# Altium schematic sheet mouse.SchDoc
size A; SheetNumber: 1; SheetTotal: 1
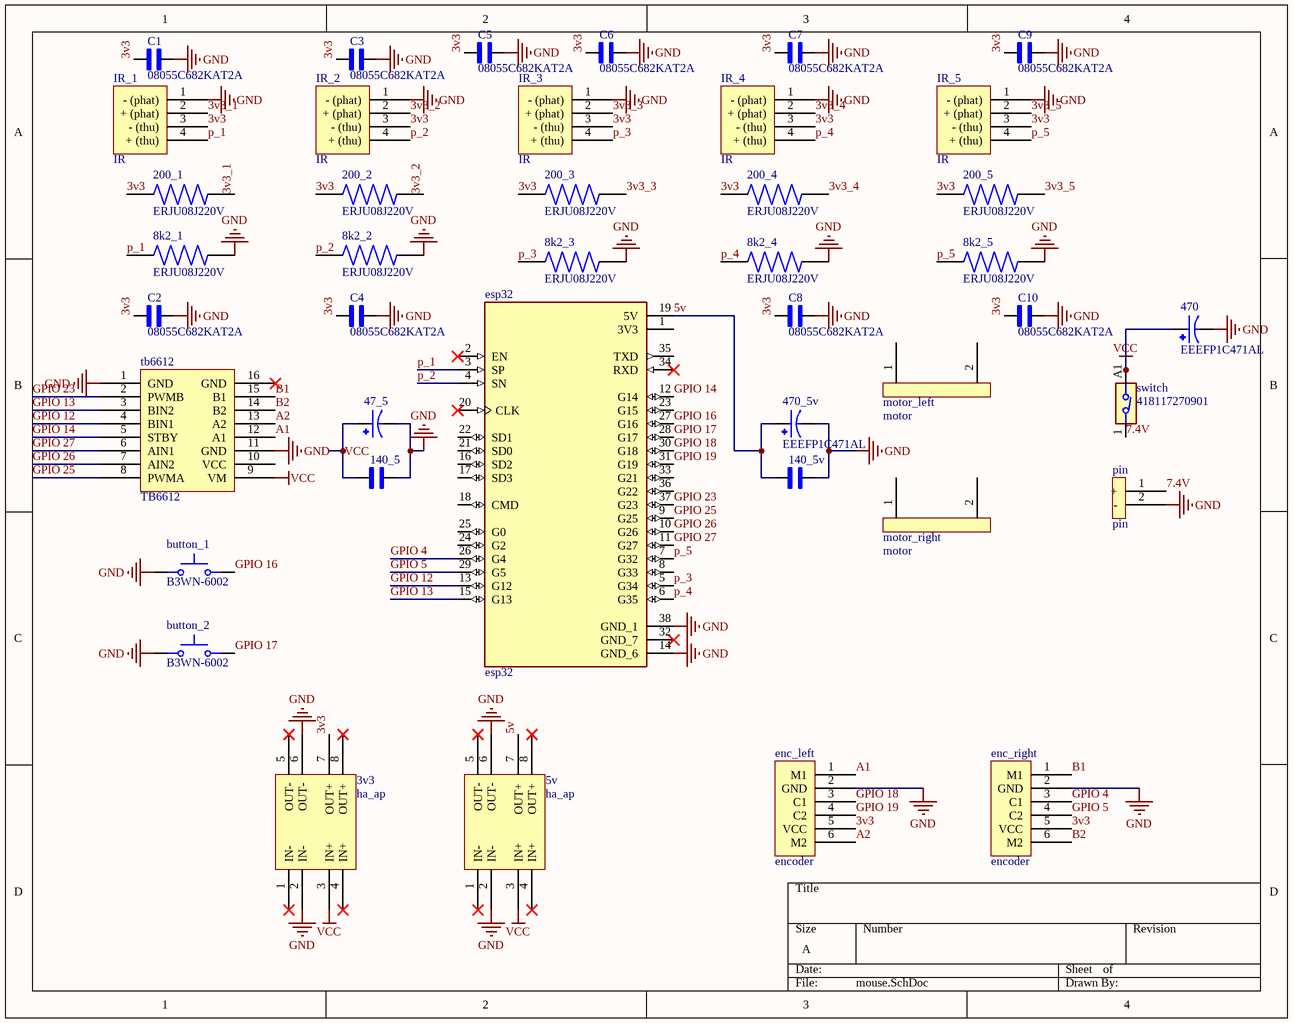
[diagram p0: mouse.SchDoc]

## Parts
3v3  ha_ap  [ha_ap]
5v  ha_ap  [ha_ap]
8k2_1  ERJU08J220V  [RES_ERJU08J220V]
8k2_2  ERJU08J220V  [RES_ERJU08J220V]
8k2_3  ERJU08J220V  [RES_ERJU08J220V]
8k2_4  ERJU08J220V  [RES_ERJU08J220V]
8k2_5  ERJU08J220V  [RES_ERJU08J220V]
47_5  EEEFK1C470V  [CAP_EEEFK1C470V]  (value not drawn)
140_5  08055C682KAT2A  [CAPC2012X94N]  (value not drawn)
140_5v  08055C682KAT2A  [CAPC2012X94N]  (value not drawn)
200_1  ERJU08J220V  [RES_ERJU08J220V]
200_2  ERJU08J220V  [RES_ERJU08J220V]
200_3  ERJU08J220V  [RES_ERJU08J220V]
200_4  ERJU08J220V  [RES_ERJU08J220V]
200_5  ERJU08J220V  [RES_ERJU08J220V]
470  EEEFP1C471AL  [CAP_EEEFP1C471AL]
470_5v  EEEFP1C471AL  [CAP_EEEFP1C471AL]
button_1  B3WN-6002  [SW_B3WN-6002]
button_2  B3WN-6002  [SW_B3WN-6002]
C1  08055C682KAT2A  [CAPC2012X94N]
C2  08055C682KAT2A  [CAPC2012X94N]
C3  08055C682KAT2A  [CAPC2012X94N]
C4  08055C682KAT2A  [CAPC2012X94N]
C5  08055C682KAT2A  [CAPC2012X94N]
C6  08055C682KAT2A  [CAPC2012X94N]
C7  08055C682KAT2A  [CAPC2012X94N]
C8  08055C682KAT2A  [CAPC2012X94N]
C9  08055C682KAT2A  [CAPC2012X94N]
C10  08055C682KAT2A  [CAPC2012X94N]
enc_left  encoder  [encoder]
enc_right  encoder  [encoder]
esp32  esp32  [esp32]
IR_1  IR  [IR]
IR_2  IR  [IR]
IR_3  IR  [IR]
IR_4  IR  [IR]
IR_5  IR  [IR]
motor_left  motor  [motor]
motor_right  motor  [motor]
pin  pin  [pin]
switch  418117270901  [418117270901]
tb6612  TB6612  [TB6612]

## Nets
GND: 3v3.2(IN-) 3v3.6(OUT-) 5v.2(IN-) 5v.6(OUT-) 8k2_1.2 8k2_2.2 8k2_3.2 8k2_4.2 8k2_5.2 47_5.2 140_5.2 140_5v.2 470.2 470_5v.2 button_1.1 button_2.1 C1.2 C2.2 C3.2 C4.2 C5.2 C6.2 C7.2 C8.2 C9.2 C10.2 enc_left.2(GND) enc_right.2(GND) esp32.14(GND_6) esp32.38(GND_1) IR_1.1(-_(phat)) IR_2.1(-_(phat)) IR_3.1(-_(phat)) IR_4.1(-_(phat)) IR_5.1(-_(phat)) pin.2(-) tb6612.1(GND) tb6612.11(GND)
VCC: 3v3.3(IN+) 5v.3(IN+) 47_5.1 140_5.1 470.1 switch.A1 tb6612.9(VM)
3v3: 3v3.7(OUT+) 200_1.1 200_2.1 200_3.1 200_4.1 200_5.1 C1.1 C2.1 C3.1 C4.1 C5.1 C6.1 C7.1 C8.1 C9.1 C10.1 enc_left.5(VCC) enc_right.5(VCC) IR_1.3(-_(thu)) IR_2.3(-_(thu)) IR_3.3(-_(thu)) IR_4.3(-_(thu)) IR_5.3(-_(thu))
3v3_1: 200_1.2 IR_1.2(+_(phat))
3v3_2: 200_2.2 IR_2.2(+_(phat))
3v3_3: 200_3.2 IR_3.2(+_(phat))
3v3_4: 200_4.2 IR_4.2(+_(phat))
3v3_5: 200_5.2 IR_5.2(+_(phat))
5v: 5v.7(OUT+) 140_5v.1 470_5v.1 esp32.19(5V)
7.4V: pin.1(+) switch.1
A1: enc_left.1(M1) tb6612.12(A1)
A2: enc_left.6(M2) tb6612.13(A2)
B1: enc_right.1(M1) tb6612.15(B1)
B2: enc_right.6(M2) tb6612.14(B2)
GPIO 4: enc_right.3(C1) esp32.26(G4)
GPIO 5: enc_right.4(C2) esp32.29(G5)
GPIO 12: esp32.13(G12) tb6612.4(BIN1)
GPIO 13: esp32.15(G13) tb6612.3(BIN2)
GPIO 14: esp32.12(G14) tb6612.5(STBY)
GPIO 16: button_1.2 esp32.27(G16)
GPIO 17: button_2.2 esp32.28(G17)
GPIO 18: enc_left.3(C1) esp32.30(G18)
GPIO 19: enc_left.4(C2) esp32.31(G19)
GPIO 23: esp32.37(G23) tb6612.2(PWMB)
GPIO 25: esp32.9(G25) tb6612.8(PWMA)
GPIO 26: esp32.10(G26) tb6612.7(AIN2)
GPIO 27: esp32.11(G27) tb6612.6(AIN1)
p_1: 8k2_1.1 esp32.3(SP) IR_1.4(+_(thu))
p_2: 8k2_2.1 esp32.4(SN) IR_2.4(+_(thu))
p_3: 8k2_3.1 esp32.5(G34) IR_3.4(+_(thu))
p_4: 8k2_4.1 esp32.6(G35) IR_4.4(+_(thu))
p_5: 8k2_5.1 esp32.7(G32) IR_5.4(+_(thu))

Not connected (* = marked no-connect by the designer): 3v3 1(IN-)* 4(IN+)* 5(OUT-)* 8(OUT+)*; 5v 1(IN-)* 4(IN+)* 5(OUT-)* 8(OUT+)*; esp32 1(3V3) 2(EN)* 8(G33) 16(SD2) 17(SD3) 18(CMD) 20(CLK)* 21(SD0) 22(SD1) 23(G15) 24(G2) 25(G0) 32(GND_7)* 33(G21) 34(RXD)* 35(TXD) 36(G22); motor_left 1(41) 2(40); motor_right 1(41) 2(40); tb6612 10(VCC) 16(GND)*

## Library data of the parts
47_5 = EEEFK1C470V: CAP ALUM 47UF 20% 16V SMD; MF: Panasonic; Price: None; Purchase-URL: https://pricing.snapeda.com/search/part/EEEFK1C470V/?ref=eda; Package: RADIAL-2 Panasonic; Check_prices: https://www.snapeda.com/parts/EEEFK1C470V/Panasonic/view-part/?ref=eda; Value: *; SnapEDA_Link: https://www.snapeda.com/parts/EEEFK1C470V/Panasonic/view-part/?ref=snap; Availability: In Stock; MP: EEEFK1C470V
140_5 140_5v C1-C10 = 08055C682KAT2A: Capacitor MLCC 0805 6.8nF 50V | AVX 08055C682KAT2A; SnapEDA_Link: https://www.snapeda.com/parts/08055C682KAT2A/AVX/view-part/?ref=snap; Package: 2012 AVX; Value: *; MF: AVX; MP: 08055C682KAT2A; Check_prices: https://www.snapeda.com/parts/08055C682KAT2A/AVX/view-part/?ref=eda
470 470_5v = EEEFP1C471AL: CAP ALUM 470UF 20% 16V SMD; MF: Panasonic; SnapEDA_Link: https://www.snapeda.com/parts/EEEFP1C471AL/Panasonic/view-part/?ref=snap; Package: RADIAL-2 Panasonic; Value: *; MP: EEEFP1C471AL; Check_prices: https://www.snapeda.com/parts/EEEFP1C471AL/Panasonic/view-part/?ref=eda
button_1 button_2 = B3WN-6002: Tactile Switch SPST-NO Top Actuated Through Hole; MF: Omron Electronics; Availability: In Stock; Price: None; Package: None; MP: B3WN-6002; Value: *; SnapEDA_Link: https://www.snapeda.com/parts/B3WN-6002/Omron+Electronics+Inc-EMC+Div/view-part/?ref=snap; Check_prices: https://www.snapeda.com/parts/B3WN-6002/Omron+Electronics+Inc-EMC+Div/view-part/?ref=eda; Purchase-URL: https://pricing.snapeda.com/search/part/B3WN-6002/?ref=eda
switch = 418117270901: Dip Switch SPST 1 Position Through Hole Slide (Standard) Actuator 25mA 24VDC; MF: WÃ¼rth Elektronik; SnapEDA_Link: https://www.snapeda.com/parts/418117270901/W%25C3%25BCrth+Elektronik+Midcom/view-part/?ref=snap; Package: None; Value: *; MP: 418117270901; Check_prices: https://www.snapeda.com/parts/418117270901/W%25C3%25BCrth+Elektronik+Midcom/view-part/?ref=eda
8k2_1-8k2_5 200_1-200_5 = ERJU08J220V: Package: None; Value: *; MP: ERJU08J220V; Availability: Unavailable; Price: None